# Altium schematic sheet short circuit protection.SchDoc
size A; SheetNumber: 1; SheetTotal: 1; SPICEModelCacheSRBBZSZI: <root> / <DocumentId>SRBBZSZI</DocumentId> / <CacheFrame Number="0"> / <Model Name="2n3904" Kind="MDL"> / <Text>*2N3904 / *Si 310mW  40V 200mA 300MHz pkg:TO-92B 1,2,3 / .MODEL 2N3904 NPN(IS=1.4E-14 BF=300 VAF=100 IKF=0.025 ISE=3E-13 / + BR=7.5 RC=2.4 CJE=4.5E-12 TF=4E-10 CJC=3.5E-12 TR=2.1E-8 XTB=1.5 KF=9E-16 )</Text> / </Model> / <Model Name="1n4007" Kind="MDL"> / <Text>*1N4007 MCE 8-16-95 / *1000V 1A Si GenPurpose Diode pkg:DIODE0.4 1,2 / .MODEL 1N4007 D(IS=2.55E-9 RS=0.042 N=1.75 TT=5.76E-6 CJO=1.85E-11 / + VJ=0.75 M=0.333 BV=1000 IBV=9.86E-5 )</Text> / </Model> / </CacheFrame> / </root>
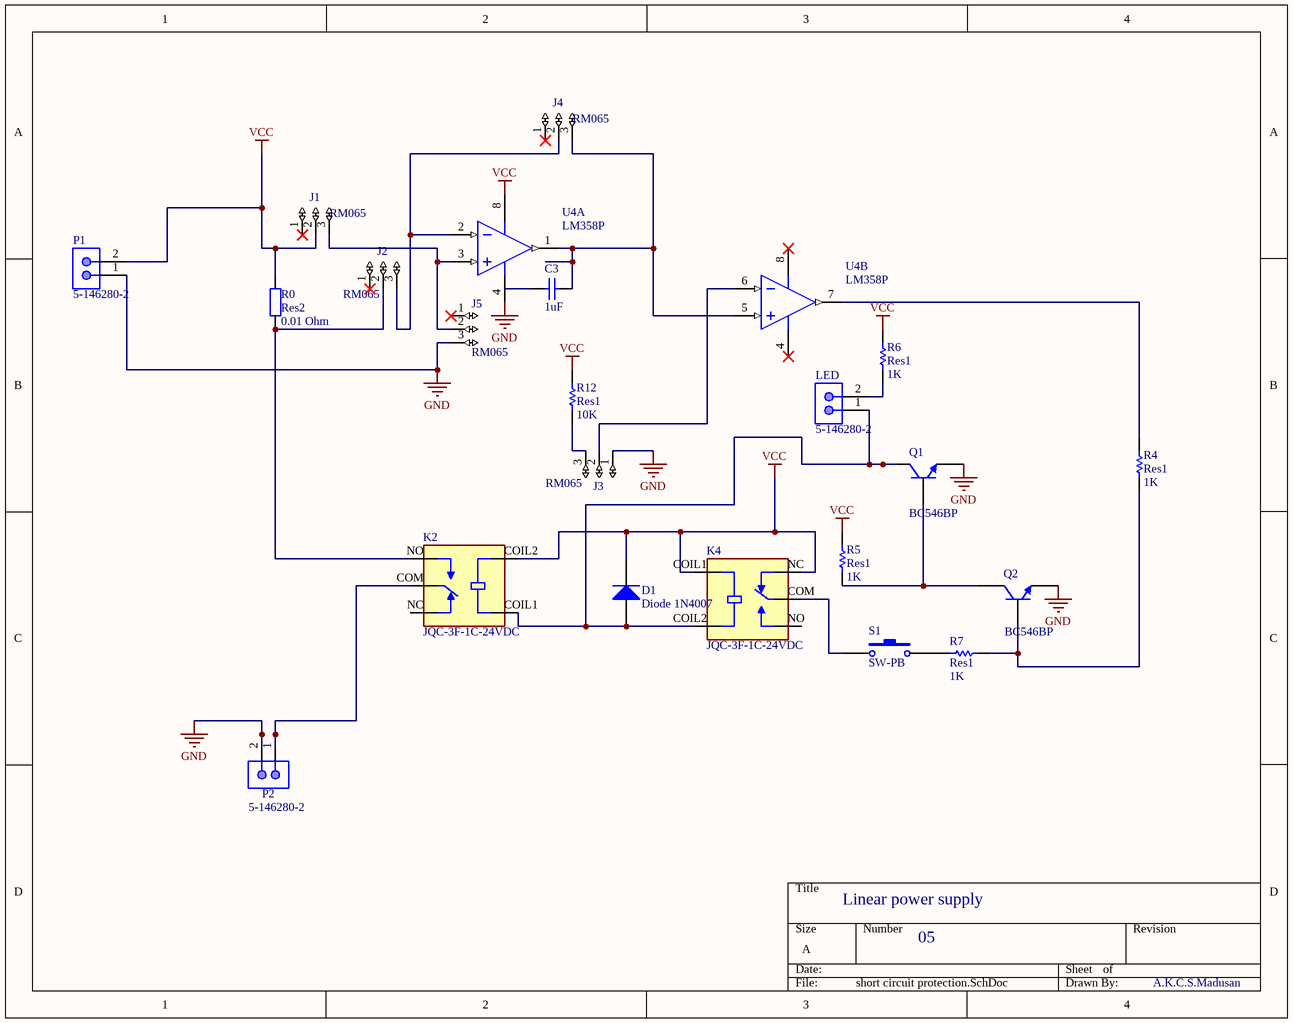
[diagram p0: short circuit protection.SchDoc]

## Parts
C3  C3: 1uF  (hidden comment: Capacitor)
D1  Diode 1N4007  [DO-41]
J1  RM065  [RM065]
J2  RM065  [RM065]
J3  RM065  [RM065]
J4  RM065  [RM065]
J5  RM065  [RM065]
K2  JQC-3F-1C-24VDC  [RELAY_JQC-3F-1C-24VDC]
K4  JQC-3F-1C-24VDC  [RELAY_JQC-3F-1C-24VDC]
LED  5-146280-2  [TECO-5-146280-2_V]
P1  5-146280-2  [TECO-5-146280-2_V]
P2  5-146280-2  [TECO-5-146280-2_V]
Q1  BC546BP  [TO-92A]
Q2  BC546BP  [TO-92A]
R0  Res2  value 0.01 Ohm  [AXIAL-0.4]
R4  Res1  value 1K  [AXIAL-0.3]
R5  Res1  value 1K  [AXIAL-0.3]
R6  Res1  value 1K  [AXIAL-0.3]
R7  Res1  value 1K  [AXIAL-0.3]
R12  Res1  value 10K  [AXIAL-0.3]
S1  SW-PB  [SPST-2]
U4  LM358P  [P0008A]  (parts A,B of 2)

## Nets
GND: J3.1(P$1) J5.3(P$3) P1.1 P2.2 Q1.1(E) Q2.1(E) U4.4(GND)
VCC: D1.2(K) J1.2(P$2) K2.COIL2 K4.COIL1 K4.NC P1.2 R0.2 R5.2 R6.2 R12.2 U4.8(VCC)
NetC3_2: C3.2 J4.3(P$3) U4.1(1OUT) U4.5(2IN+)
NetD1_1: D1.1(A) K2.COIL1 K4.COIL2 LED.1 Q1.3(C)
NetJ1_3: J1.3(P$3) J5.2(P$2) U4.3(1IN+)
NetJ2_2: J2.2(P$2) K2.NO R0.1
NetJ2_3: J2.3(P$3) J4.2(P$2) U4.2(1IN-)
NetJ3_2: J3.2(P$2) U4.6(2IN-)
NetJ3_3: J3.3(P$3) R12.1
NetK2_COM: K2.COM P2.1
NetK4_COM: K4.COM S1.1
NetLED_2: LED.2 R6.1
NetQ1_2: Q1.2(B) Q2.3(C) R5.1
NetQ2_2: Q2.2(B) R4.1 R7.2
NetR4_2: R4.2 U4.7(2OUT)
NetR7_1: R7.1 S1.2

Not connected (* = marked no-connect by the designer): C3 1; J1 1(P$1)*; J2 1(P$1)*; J4 1(P$1)*; J5 1(P$1)*; K2 NC; K4 NO

## Notes on the sheet
- Linear power supply
- 05
- A.K.C.S.Madusan

## Library data of the parts
C3 = Capacitor: SimulationGenericComponent: True
D1 = Diode 1N4007: 1 Amp General Purpose Rectifier; Published: 8-Jun-2000; LatestRevisionDate: 17-Jul-2002; LatestRevisionNote: Re-released for DXP Platform.; DatasheetVersion: 1998; PackageVersion: Aug-1999; PackageReference: DO-41; Publisher: Altium Limited; PackageDescription: Diode, Axial; Body 5.2 x 2.7 mm (LxDia. max), Lead Dia. 0.86 mm (max); Code_JEDEC: DO-204-AL; ComponentLink1Description: Manufacturer Link; ComponentLink1URL: http://www.fairchildsemi.com/; ComponentLink2Description: Datasheet; ComponentLink2URL: http://www.fairchildsemi.com/ds/1N%2F1N4001.pdf
J1-J5 = RM065: Circuit Breaker Thermal 6.5A 240V AC 60V DC Rocker Panel Mount, Snap-In; MP: RM-065; MF: Vishay; Value: *; Package: None; Availability: Not in stock; SnapEDA_Link: https://www.snapeda.com/parts/RM-065/Vishay/view-part/?ref=snap; Price: None; Check_prices: https://www.snapeda.com/parts/RM-065/Vishay/view-part/?ref=eda
K2 K4 = JQC-3F-1C-24VDC: Miniature PCB Relay 24VDC, 10A 250VAC, 15A 125VAC, 10A 250VAC; Price: None; Availability: Unavailable; MP: JQC-3F-1C-24VDC; Value: *; Package: None
LED P1 P2 = CMP-2000-07492-1: Male Header, Pitch 2.54 mm, 1 x 2 Position, Height 8.21 mm, Tail Length 3.05 mm, -65 to 105 degC, RoHS, Bulk; Manufacturer: TE Connectivity; Mating Connector Lock: No(Without); Number of Positions: 2; Pitch: 2.54mm; PCB Mounting Orientation: Vertical; Keyed: No; Case\/Package: 100; Mating Post Length: 0.23inch; High Temperature Housing: Yes; Max Current Rating: 5A; PCB Thickness: 0.063inch; PCB Mount Retention: Without; Approvals: CSA; Current Rating: 3A; Radiation Hardening: No; Length: 4.67mm; Contact Mating Length: 0.23inch; Connector Type: Header; Number of Rows: 1; Termination Post Length: 0.12inch; Board Standoff: No(Without); Max Operating Temperature: 105degC; Contact Shape: Square; Selectively Loaded: No(Without); Gasket: No(Without); Number of Contacts: 2; Contact Gender: Male; Mating Alignment: No(Without); Manufacturer URL: http://www.te.com/; Datasheet URL: http://www.te.com/commerce/DocumentDelivery/DDEController?Action=showdoc&DocId=Customer+Drawing%7F146280%7FH1%7Fpdf%7FEnglish%7FENG_CD_146280_H1.pdf%7F5-146280-2; Mount: ThroughHole; Orientation: Straight; Packaging: Carton; Package Reference: 5-146280-2; Package Quantity: 500; Stabilizers: No(Without); Row Spacing: 2.54mm; Contact Material: CopperAlloy; Panel Mount Retention: No(Without); Datasheet Version: Rev. H1, 08/2016; Housing Colour: Black; Colour: Black; Package Description: Male Header, Pitch 2.54 mm, 1 x 2 Position, Height 8.21 mm, Tail Length 3.05 mm; Contact Plating: Matte; Housing Material: Polymer; Contact Protection: No(Without); Min Operating Temperature: -65degC; Mounting Technology: ThroughHole; Flammability Rating: UL94V-0; RoHSCompliant: true; Termination: ThroughHole; Depth: 2.34mm; High Speed Serial Data Connector: No
Q1 Q2 = 2N3904: NPN General Purpose Amplifier; Published: 8-Jun-2000; LatestRevisionDate: 15-Jan-2003; LatestRevisionNote: PCB Footprint 'BCY-W3/D4.7' replaced; DatasheetVersion: 1997; PackageVersion: Sep-1998; PackageReference: TO-92A; Publisher: Altium Limited; PackageDescription: TO, Flat Index; 3 In-Line, Axial Leads; Body Dia. 4.5mm; Leads 0.51 x 0.48 mm (max); ComponentLink1Description: Manufacturer Link; ComponentLink1URL: http://www.fairchildsemi.com/; ComponentLink2Description: Datasheet; ComponentLink2URL: http://www.fairchildsemi.com/ds/2N%2F2N3904.pdf
R0 = Res2: Resistor; Published: 8-Jun-2000; LatestRevisionDate: 17-Jul-2002; LatestRevisionNote: Re-released for DXP Platform.; PackageReference: AXIAL-0.4; Publisher: Altium Limited; PackageDescription: Axial Device, Thru-Hole; 2 Leads; 0.4 in Pin Spacing
R4-R7 R12 = Res1: Resistor; Published: 8-Jun-2000; LatestRevisionDate: 17-Jul-2002; LatestRevisionNote: Re-released for DXP Platform.; PackageReference: AXIAL-0.3; Publisher: Altium Limited; PackageDescription: Axial Device, Thru-Hole; 2 Leads; 0.3 in Pin Spacing
S1 = SW-PB: Switch; Published: 24-Mar-1999; LatestRevisionDate: 17-Jul-2002; LatestRevisionNote: Re-released for DXP Platform.; PackageReference: SPST-2; Publisher: Altium Limited; PackageDescription: Switch; 2 Leads
U4 = CMP-2000-06549-1: Dual Operational Amplifier, 3 to 32 V, 0 to 70 degC, 8-Pin PDIP (P), RoHS, Tape and Reel; Manufacturer: Technik Industrial; Datasheet Version: Rev. T, 04/2015; Datasheet URL: http://www.ti.com/lit/ds/symlink/lm358.pdf; Manufacturer URL: http://www.technik.com.hk/; Package Description: 8-Pin Double In-line Package, Body 9.59 x 6.35 mm, Pitch 2.54 mm; Mounting Technology: ThroughHole; Package URL: http://www.ti.com/lit/ml/mpdi001b/mpdi001b.pdf; Package Reference: P8